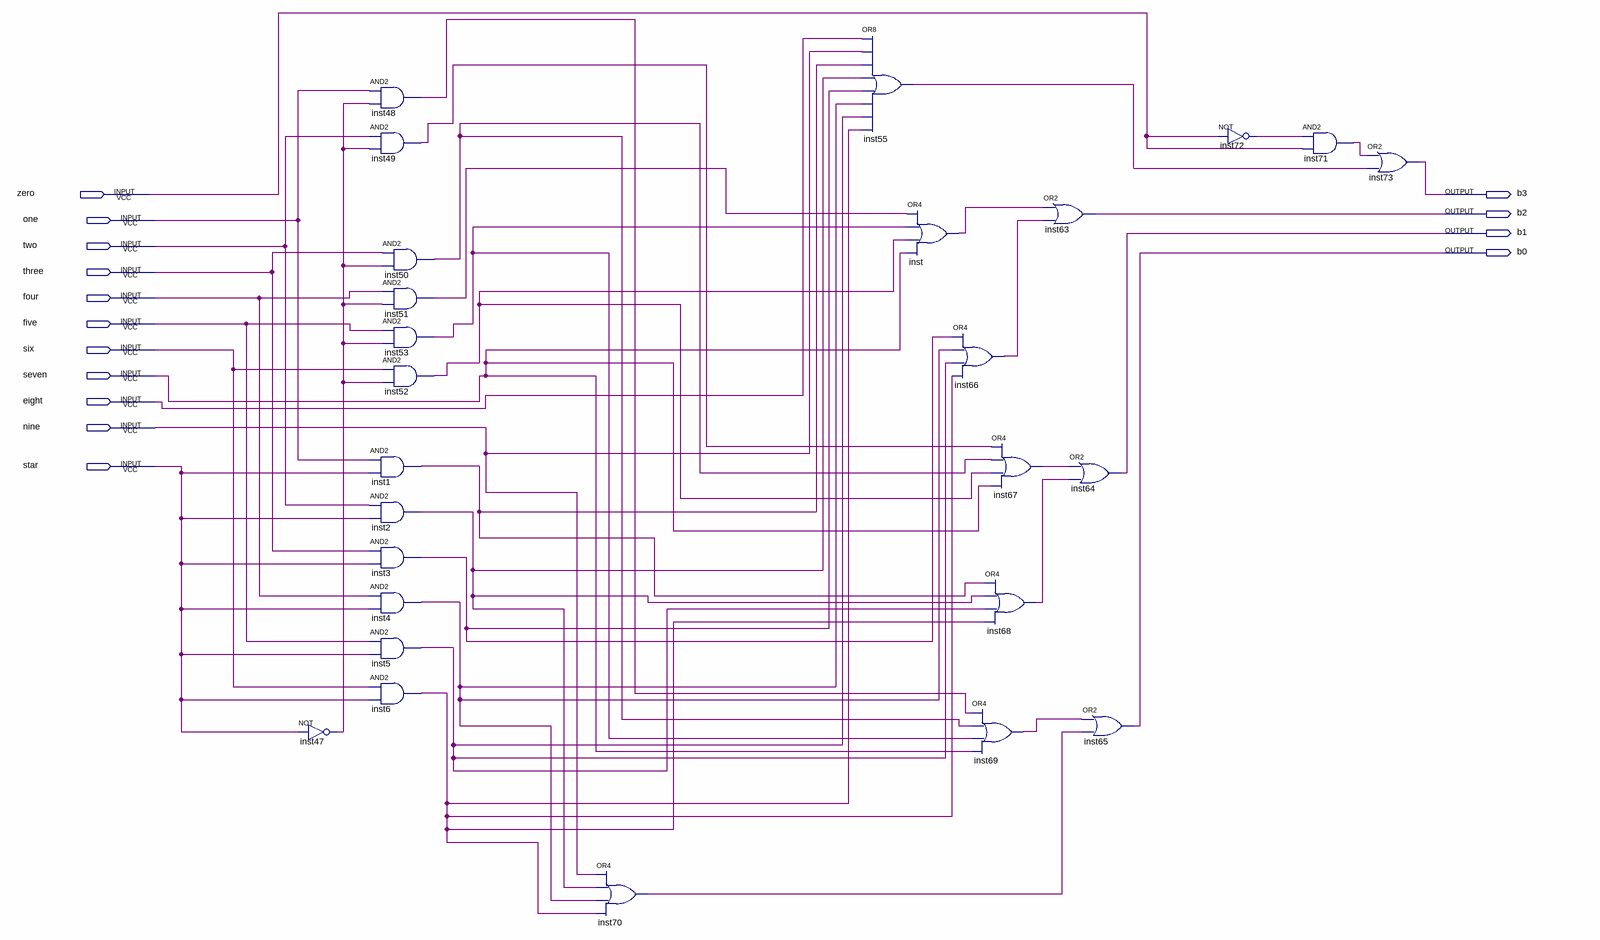
[diagram p0: schematic sheet]
// Quartus schematic keypad.bdf as structural Verilog: 26 symbols, 15 pins
module keypad (
  input  zero,
  input  one,
  input  two,
  input  three,
  input  four,
  input  five,
  input  six,
  input  seven,
  input  eight,
  input  nine,
  input  star,
  output b3,
  output b2,
  output b1,
  output b0
);

  wire inst1_out, inst2_out, inst3_out, inst4_out, inst5_out, inst6_out, inst47_out, inst48_out, inst49_out,
       inst50_out, inst51_out, inst52_out, inst53_out, inst55_out, inst66_out, inst67_out, inst68_out,
       inst69_out, inst70_out, inst71_out, inst72_out, inst_out;

  not inst47 (inst47_out, star);
  and inst48 (inst48_out, one, inst47_out);
  and inst49 (inst49_out, two, inst47_out);
  and inst50 (inst50_out, three, inst47_out);
  and inst51 (inst51_out, four, inst47_out);
  and inst53 (inst53_out, five, inst47_out);
  and inst52 (inst52_out, six, inst47_out);
  and inst1 (inst1_out, one, star);
  and inst2 (inst2_out, two, star);
  and inst3 (inst3_out, three, star);
  and inst4 (inst4_out, four, star);
  and inst5 (inst5_out, five, star);
  and inst6 (inst6_out, six, star);
  or inst70 (inst70_out, nine, inst2_out, inst4_out, inst6_out);
  or inst55 (inst55_out, eight, nine, inst1_out, inst2_out, inst3_out, inst4_out, inst5_out, inst6_out);
  or inst (inst_out, inst51_out, inst53_out, inst52_out, seven);
  or inst66 (inst66_out, inst3_out, inst4_out, inst5_out, inst6_out);
  or inst69 (inst69_out, inst48_out, inst50_out, inst53_out, seven);
  or inst67 (inst67_out, inst49_out, inst50_out, inst52_out, seven);
  or inst68 (inst68_out, inst1_out, inst2_out, inst5_out, inst6_out);
  or inst63 (b2, inst_out, inst66_out);
  or inst64 (b1, inst67_out, inst68_out);
  or inst65 (b0, inst69_out, inst70_out);
  not inst72 (inst72_out, zero);
  and inst71 (inst71_out, inst72_out, zero);
  or inst73 (b3, inst71_out, inst55_out);
endmodule
